# Altium schematic sheet touch.SchDoc
size A4
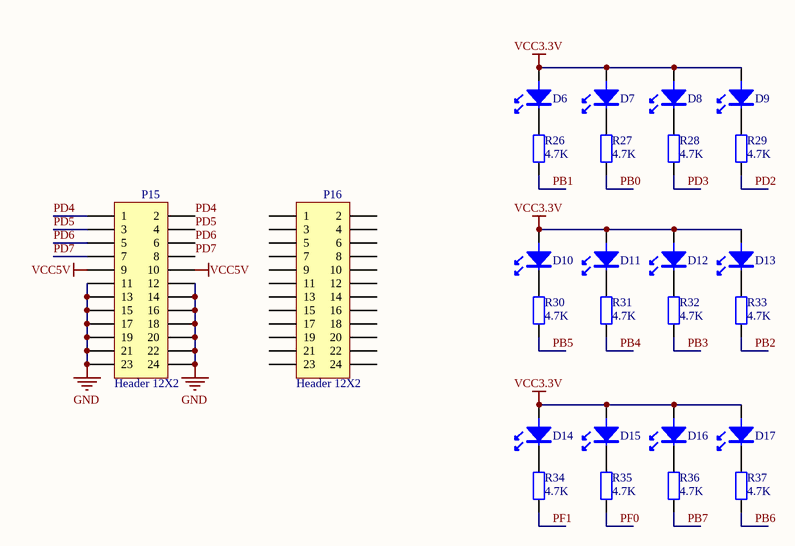
[diagram p0: touch.SchDoc]

## Parts
D6  LED  [0603_LED_S1]  (value not drawn)
D7  LED  [0603_LED_S1]  (value not drawn)
D8  LED  [0603_LED_S1]  (value not drawn)
D9  LED  [0603_LED_S1]  (value not drawn)
D10  LED  [0603_LED_S1]  (value not drawn)
D11  LED  [0603_LED_S1]  (value not drawn)
D12  LED  [0603_LED_S1]  (value not drawn)
D13  LED  [0603_LED_S1]  (value not drawn)
D14  LED  [0603_LED_S1]  (value not drawn)
D15  LED  [0603_LED_S1]  (value not drawn)
D16  LED  [0603_LED_S1]  (value not drawn)
D17  LED  [0603_LED_S1]  (value not drawn)
P15  Header 12X2  [2.0mm 2*12P直排母]
P16  Header 12X2  [2.0mm 2*12P直排母]
R26  4.7K  [0603_R]
R27  4.7K  [0603_R]
R28  4.7K  [0603_R]
R29  4.7K  [0603_R]
R30  4.7K  [0603_R]
R31  4.7K  [0603_R]
R32  4.7K  [0603_R]
R33  4.7K  [0603_R]
R34  4.7K  [0603_R]
R35  4.7K  [0603_R]
R36  4.7K  [0603_R]
R37  4.7K  [0603_R]

## Nets
GND: P15.11 P15.12 P15.13 P15.14 P15.15 P15.16 P15.17 P15.18 P15.19 P15.20 P15.21 P15.22 P15.23 P15.24
VCC3.3V: D6.A D7.A D8.A D9.A D10.A D11.A D12.A D13.A D14.A D15.A D16.A D17.A
VCC5V: P15.9 P15.10
PB0: R27.1
PB1: R26.1
PB2: R33.1
PB3: R32.1
PB4: R31.1
PB5: R30.1
PB6: R37.1
PB7: R36.1
PD2: R29.1
PD3: R28.1
PD4: P15.1 P15.2
PD5: P15.3 P15.4
PD6: P15.5 P15.6
PD7: P15.7 P15.8
PF0: R35.1
PF1: R34.1
NetD6_K: D6.K R26.2
NetD7_K: D7.K R27.2
NetD8_K: D8.K R28.2
NetD9_K: D9.K R29.2
NetD10_K: D10.K R30.2
NetD11_K: D11.K R31.2
NetD12_K: D12.K R32.2
NetD13_K: D13.K R33.2
NetD14_K: D14.K R34.2
NetD15_K: D15.K R35.2
NetD16_K: D16.K R36.2
NetD17_K: D17.K R37.2

Not connected (* = marked no-connect by the designer): P16 1 2 3 4 5 6 7 8 9 10 11 12 13 14 15 16 17 18 19 20 21 22 23 24

## Library data of the parts
D6-D17 = LED: 贴片LED，0603，白色
P15 P16 = Header 12X2: Header, 12-Pin, Dual row; LatestRevisionDate: 17-Jul-2002; LatestRevisionNote: Re-released for DXP Platform.; Publisher: Altium Limited
R26-R37 = Res2: 贴片电阻，0603